# Altium project ELOAD.PrjPcb (part 2 of 2)

## Sheet INKEY.SchDoc: =DocumentName
size A4; CompanyName: "AS Manufacturing" LLC; Organization: "AS Manufacturing" LLC; Address1: 5 Sklyarenka St.; Address2: Kyiv 04073; Address3: Ukraine; Address4: https://ajax.systems/en/; DocumentNumber: 6; Revision: v1; SheetNumber: 6; SheetTotal: 7; Product name: DEV.Tnn.BRD; Internal reference: 621; Head: DEV.Tnn.BRD.621.v1; PCB_Designator: DEV.Tnn.BRD.621.v1; Template_version: 1.0.1
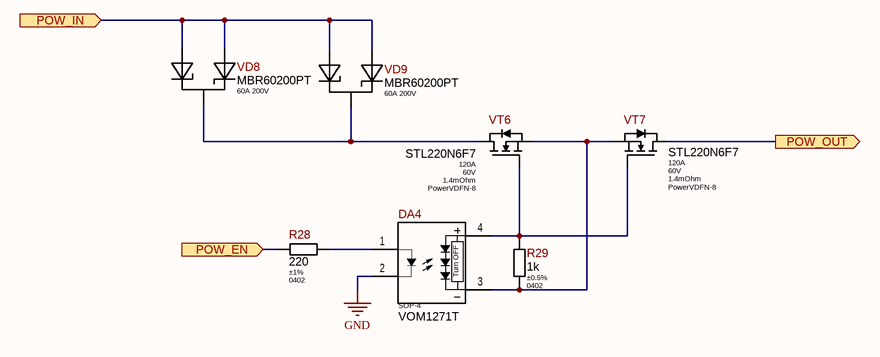
[diagram p5: INKEY.SchDoc]

### Parts
DA4  Package: SOP-4  [SOP-4P254_492X720X222L65X51N]  (hidden comment: VOM1271T)
R28  Tolerance: ±1%  Package: 0402  [R_ANY_CHIP_0402_MED]  (hidden comment: 220)
R29  Tolerance: ±0.5%  Package: 0402  [R_ANY_CHIP_0402_MED]  (hidden comment: 1k)
VD8  MBR60200PT  Power Rating: 60A 200V  [TO220-AB-H]
VD9  MBR60200PT  Power Rating: 60A 200V  [TO220-AB-H]
VT6  Id: 120A  Vds: 60V  Rds: 1.4mOhm  Package: PowerVDFN-8  [VSONP-CLIP-8_5.0x6.00mm]  (hidden comment: STL220N6F7)
VT7  Id: 120A  Vds: 60V  Rds: 1.4mOhm  Package: PowerVDFN-8  [VSONP-CLIP-8_5.0x6.00mm]  (hidden comment: STL220N6F7)

### Ports
POW_EN (in), POW_IN (in), POW_OUT (out)

### Nets
EXTI: VD8.1 VD8.3 VD9.1 VD9.3 ; port POW_IN
GND: DA4.2(Cathode)
POWER: VT7.D(Drain) ; port POW_OUT
cPOW_EN: R28.1 ; port POW_EN
NetDA4_1: DA4.1(Anode) R28.2
NetDA4_3: DA4.3(Emitter) R29.2 VT6.S(Source) VT7.S(Source)
NetDA4_4: DA4.4(Collector) R29.1 VT6.G(Gate) VT7.G(Gate)
NetVD8_2: VD8.2 VD9.2 VT6.D(Drain)

### Notes on the sheet
- Title
- Product:
- Project:
- Size:
- Date:
- Variant:
- A4
- Authors:
- Time:
- Sheet
- of
- Rev:
- Commit:
- (in symbol VOM1271T) Turn OFF

### Library data of the parts
DA4 = VOM1271T: Photovoltaic MOSFET Driver with Integrated Fast Turn-Off, 3750 VRMS; Manufacturer: Vishay Semiconductors; Ajax_1C_ID: 15545; Ajax_1C_PN: VOM1271T оптрон; Ajax_1С_Status: Mass Production; Component Status: Released; Wavelength: NONE; GUID_1C: d92e23f6-5530-11e9-ab4e-0050569f2651; Part Number: VOM1271T; Part Type: Optocoupler; Component Type: SMD; Color: NONE; Temperature Range: -40°C ~ 100°C; ComponentLink1URL: https://www.vishay.com/docs/83469/vom1271.pdf; Supplier 1: Digi-Key; Supplier Part Number 1: VOM1271TTR-ND; Replacement: NONE; Price: 1.2896; ComponentLink1Description: Datasheet
R28 = RC0402FR-07220RL: 220 Ohms ±1% 1/16W 0402 Thick Film Resistor; Manufacturer: Yageo; Ajax_1C_ID: 6466; Ajax_1C_PN: 220R 1% 0402 Resistors SMD RoHS; Ajax_1С_Status: Mass Production; Component Status: Released; Power Rating: 0.062W; Voltage: 50V; Temperature Stability: ±100ppm/°C; Replacement: NONE; GUID_1C: c8eea36b-fd66-11e4-ad28-a45d36c4a9e5; Value: 220; Part Number: RC0402FR-07220RL; Part Type: Thick Film; Component Type: SMD; Temperature Range: -55°C ~ 155°C; ComponentLink1URL: https://eu.mouser.com/datasheet/2/447/PYu_RC_Group_51_RoHS_L_10-1664068.pdf; Price: 0.0007; ComponentLink1Description: Datasheet
R29 = RC0402DR-071KL: 1 kOhms ±0.5% 1/16W 0402 Thick Film Resistor; Manufacturer: Yageo; Ajax_1C_ID: 54619; Ajax_1C_PN: 1k 0.5% 0402 RC0402DR-071KL Resistors SMD RoHS; Ajax_1С_Status: Mass Production; Component Status: Released; Power Rating: 0.062W; Voltage: 50V; Temperature Stability: ±100ppm/°C; Replacement: NONE; GUID_1C: a470e21a-6423-11ed-a366-005056994834; Value: 1k; Part Number: RC0402DR-071KL; Part Type: Thick Film; Component Type: SMD; Temperature Range: -55°C ~ 155°C; ComponentLink1URL: https://www.yageo.com/upload/media/product/productsearch/datasheet/rchip/PYu-RC_Group_51_RoHS_L_12.pdf; Supplier 1: Digi-Key; Supplier Part Number 1: 13-RC0402DR-071KLTR-ND; Price: 0.015; ComponentLink1Description: Datasheet
VD8 VD9 = MBR60200PT: DIODE ARR SCHOT 200V 30A TO247-3; Manufacturer: Micro Commercial Co; Manufacturer P/N: MBR60200PT-BP; Name Component: Diode Schottky; Operation Temperature: -55°C ~ 150°C; Library Path 1: Diodes.SchLib; Part Number: MBR60200PT; Value: MBR60200PT; Package/Case: TO-247; Supplier 1: Digi-key; Supplier Part Number 1: 353-MBR60200PT-BP-ND; ComponentLink1Description: Datasheet; ComponentLink1URL: https://www.mccsemi.com/pdf/Products/MBR60200PT(TO-247).pdf
VT6 VT7 = STL220N6F7: 60V, 120A max N-Channel Power MOSFET, 1.2mOhm @ Vgs = 10V; Manufacturer: STMicroelectronics; Ajax_1C_ID: 113144; Ajax_1C_PN: STL220N6F7 60V 120A N-Channel MOSFET POWERFLAT Transistor STMicroelectronics SMD RoHS; Ajax_1С_Status: Mass Production; Component Status: Released; Standard Lead Time: 26 Weeks; Replacement: NONE; GUID_1C: 27ae4649-73fe-11ef-b976-00505699fadc; Part Number: STL220N6F7; Part Type: N-Channel; Component Type: SMD; Temperature Range: -55°C ~ 175°C; ComponentLink1URL: https://eu.mouser.com/datasheet/2/389/stl220n6f7-1851066.pdf; Supplier 1: Digi-Key; Supplier Part Number 1: 497-STL220N6F7TR-ND; Price: 1.47; ComponentLink1Description: Datasheet

## Sheet LOAD.SchDoc: =DocumentName
size 297 x 209 mm; CompanyName: "AS Manufacturing" LLC; Organization: "AS Manufacturing" LLC; Address1: 5 Sklyarenka St.; Address2: Kyiv 04073; Address3: Ukraine; Address4: https://ajax.systems/en/; DocumentNumber: 2; Revision: v1; SheetNumber: 2; SheetTotal: 7; Product name: DEV.Tnn.BRD; Internal reference: 621; Head: DEV.Tnn.BRD.621.v1; PCB_Designator: DEV.Tnn.BRD.621.v1; Template_version: 1.0.1
Used 5 times, as channels LOAD, LOAD, LOAD, LOAD, LOAD. Parts and nets are listed once, with the designators drawn on the sheet.
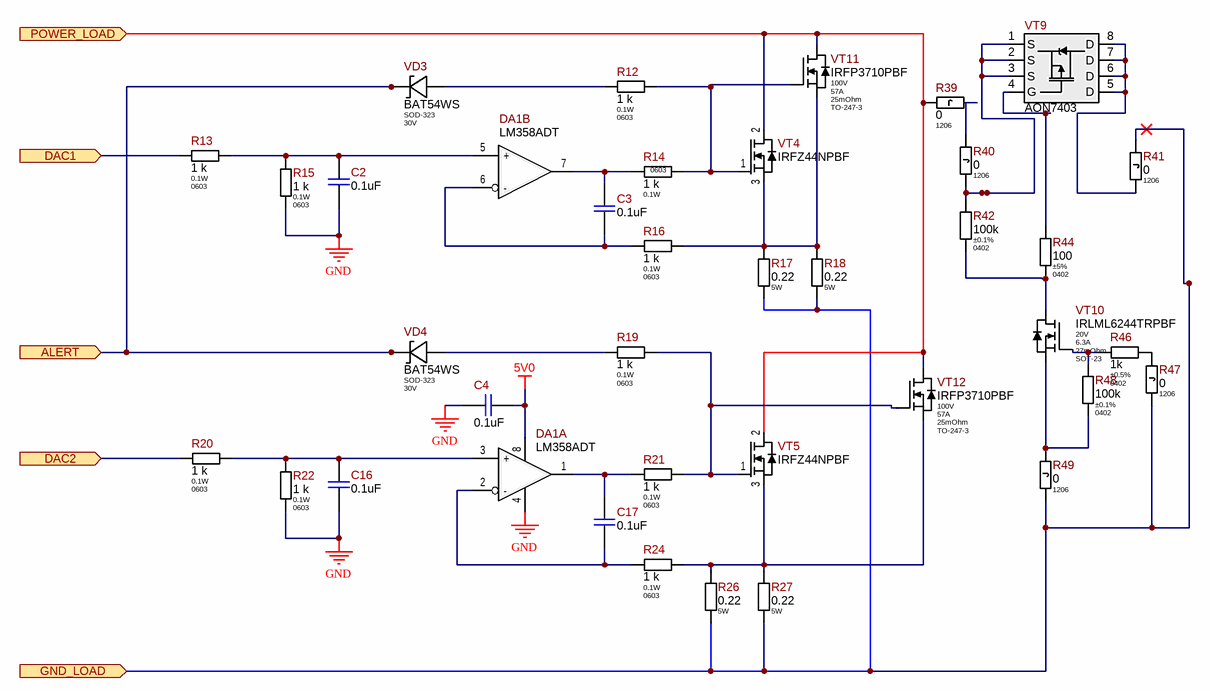
[diagram p6: LOAD.SchDoc]

### Parts
C2  0.1uF  [C0603(1608)]
C3  0.1uF  [C0603(1608)]
C4  0.1uF  [C0603(1608)]
C16  0.1uF  [C0603(1608)]
C17  0.1uF  [C0603(1608)]
DA1  LM358ADT  [SOIC8]  (parts A,B of 2)
R12  1 k  Power Rating: 0.1W  Package/Case: 0603  [R0603]
R13  1 k  Power Rating: 0.1W  Package/Case: 0603  [R0603]
R14  1 k  Power Rating: 0.1W  Package/Case: 0603  [R0603]
R15  1 k  Power Rating: 0.1W  Package/Case: 0603  [R0603]
R16  1 k  Power Rating: 0.1W  Package/Case: 0603  [R0603]
R17  0.22  Power Rating: 5W  [R5W]
R18  0.22  Power Rating: 5W  [R5W]
R19  1 k  Power Rating: 0.1W  Package/Case: 0603  [R0603]
R20  1 k  Power Rating: 0.1W  Package/Case: 0603  [R0603]
R21  1 k  Power Rating: 0.1W  Package/Case: 0603  [R0603]
R22  1 k  Power Rating: 0.1W  Package/Case: 0603  [R0603]
R24  1 k  Power Rating: 0.1W  Package/Case: 0603  [R0603]
R26  0.22  Power Rating: 5W  [R5W]
R27  0.22  Power Rating: 5W  [R5W]
R39  Package: 1206  [R_ANY_CHIP_1206_MED]  (hidden comment: 0)
R40  Package: 1206  [R_ANY_CHIP_1206_MED]  (hidden comment: 0)
R41  Package: 1206  [R_ANY_CHIP_1206_MED]  (hidden comment: 0)
R42  Tolerance: ±0.1%  Package: 0402  [R_ANY_CHIP_0402_MED]  (hidden comment: 100k)
R44  Tolerance: ±5%  Package: 0402  [R_ANY_CHIP_0402_MED]  (hidden comment: 100)
R46  Tolerance: ±0.5%  Package: 0402  [R_ANY_CHIP_0402_MED]  (hidden comment: 1k)
R47  Package: 1206  [R_ANY_CHIP_1206_MED]  (hidden comment: 0)
R48  Tolerance: ±0.1%  Package: 0402  [R_ANY_CHIP_0402_MED]  (hidden comment: 100k)
R49  Package: 1206  [R_ANY_CHIP_1206_MED]  (hidden comment: 0)
VD3  BAT54WS  Package: SOD-323  Voltage: 30V  [SOD-323_MED]
VD4  BAT54WS  Package: SOD-323  Voltage: 30V  [SOD-323_MED]
VT4  IRFZ44NPBF  [TO-220]
VT5  IRFZ44NPBF  [TO-220]
VT9  AON7403  [DFN3X3]
VT10  Part Number: IRLML6244TRPBF  Vds: 20V  Id: 6.3A  Rds: 27mOhm  Package: SOT-23  [SOT-23_MED]  (hidden comment: IRLML6244)
VT11  Vds: 100V  Id: 57A  Rds: 25mOhm  [TO-247-3]  (hidden comment: IRFP3710PBF)
VT12  Vds: 100V  Id: 57A  Rds: 25mOhm  [TO-247-3]  (hidden comment: IRFP3710PBF)

### Ports
ALERT (in), DAC1 (in), DAC2 (in), GND_LOAD (in), POWER_LOAD (in)

### Nets
5V0: C4.1 DA1.8(V+)
GND: C2.2 C4.2 C16.2 DA1.4(V-) R15.1 R22.1
ALERT: VD3.CA VD4.CA ; port ALERT
DAC1: R13.1 ; port DAC1
DAC2: R20.1 ; port DAC2
GND_LOAD: R17.1 R18.1 R26.1 R27.1 R41.1 R47.2 R49.2 ; port GND_LOAD
POWER_LOAD: R39.1 VT4.2(D) VT5.2(D) VT11.2(D) VT12.2(D) ; port POWER_LOAD
NetC2_1: C2.1 DA1.5(+) R13.2 R15.2
NetC3_1: C3.1 DA1.7(Out) R14.1
NetC3_2: C3.2 DA1.6(-) R16.1
NetC16_1: C16.1 DA1.3(+) R20.2 R22.2
NetC17_1: C17.1 DA1.1(Out) R21.1
NetC17_2: C17.2 DA1.2(-) R24.1
NetR12_1: R12.1 VD3.AN
NetR12_2: R12.2 R14.2 VT4.1(G) VT11.1(G)
NetR16_2: R16.2 R17.2 R18.2 VT4.3(S) VT11.3(S)
NetR19_1: R19.1 VD4.AN
NetR19_2: R19.2 R21.2 VT5.1(G) VT12.1(G)
NetR24_2: R24.2 R26.2 R27.2 VT5.3(S) VT12.3(S)
NetR39_2: R39.2 R40.1
NetR40_2: R40.2 R42.1 VT9.1(S) VT9.2(S) VT9.3(S)
NetR41_2: R41.2 VT9.5(D) VT9.6(D) VT9.7(D) VT9.8(D)
NetR42_2: R42.2 R44.2 VT10.3(D)
NetR44_1: R44.1 VT9.4(G)
NetR46_1: R46.1 R47.1
NetR46_2: R46.2 R48.1 VT10.1(G)
NetR48_2: R48.2 R49.1 VT10.2(S)

### Channels
LOAD: designators C2=C2E C3=C3E C4=C4E C16=C16E C17=C17E DA1=DA1E R12=R12E R13=R13E R14=R14E R15=R15E R16=R16E R17=R17E R18=R18A R19=R19E R20=R20E R21=R21E R22=R22E R24=R24E R26=R26E R27=R27A R39=R39E R40=R40E R41=R41E R42=R42E R44=R44E R46=R46E R47=R47E R48=R48E R49=R49E VD3=VD3E VD4=VD4E VT4=VT4E VT5=VT5E VT9=VT9E VT10=VT10E VT11=VT11E VT12=VT12E; ports ALERT=NetVD3A_CA DAC1=VREF5 DAC2=VREF6 GND_LOAD=NetR17B_1 POWER_LOAD=POWER
LOAD: designators C2=C2D C3=C3D C4=C4D C16=C16D C17=C17D DA1=DA1D R12=R12D R13=R13D R14=R14D R15=R15D R16=R16D R17=R17D R18=R18B R19=R19D R20=R20D R21=R21D R22=R22D R24=R24D R26=R26D R27=R27B R39=R39D R40=R40D R41=R41D R42=R42D R44=R44D R46=R46D R47=R47D R48=R48D R49=R49D VD3=VD3D VD4=VD4D VT4=VT4D VT5=VT5D VT9=VT9D VT10=VT10D VT11=VT11D VT12=VT12D; ports ALERT=NetVD3A_CA DAC1=VREF7 DAC2=VREF8 GND_LOAD=NetR17C_1 POWER_LOAD=POWER
LOAD: designators end in C; ports ALERT=NetVD3A_CA DAC1=VREF9 DAC2=VREF10 GND_LOAD=NetR17C_1 POWER_LOAD=POWER
LOAD: designators C2=C2B C3=C3B C4=C4B C16=C16B C17=C17B DA1=DA1B R12=R12B R13=R13B R14=R14B R15=R15B R16=R16B R17=R17B R18=R18D R19=R19B R20=R20B R21=R21B R22=R22B R24=R24B R26=R26B R27=R27D R39=R39B R40=R40B R41=R41B R42=R42B R44=R44B R46=R46B R47=R47B R48=R48B R49=R49B VD3=VD3B VD4=VD4B VT4=VT4B VT5=VT5B VT9=VT9B VT10=VT10B VT11=VT11B VT12=VT12B; ports ALERT=NetVD3A_CA DAC1=VREF3 DAC2=VREF4 GND_LOAD=NetR17B_1 POWER_LOAD=POWER
LOAD: designators C2=C2A C3=C3A C4=C4A C16=C16A C17=C17A DA1=DA1A R12=R12A R13=R13A R14=R14A R15=R15A R16=R16A R17=R17A R18=R18E R19=R19A R20=R20A R21=R21A R22=R22A R24=R24A R26=R26A R27=R27E R39=R39A R40=R40A R41=R41A R42=R42A R44=R44A R46=R46A R47=R47A R48=R48A R49=R49A VD3=VD3A VD4=VD4A VT4=VT4A VT5=VT5A VT9=VT9A VT10=VT10A VT11=VT11A VT12=VT12A; ports ALERT=NetVD3A_CA DAC1=VREF1 DAC2=VREF2 GND_LOAD=NetR17A_1 POWER_LOAD=POWER

### Notes on the sheet
- 1
- 2
- 3
- 4
- 5
- 6
- C
- D
- E
- F
- Назва проекту
- Мова
- UA
- Розробник
- Формат
- A4
- Версія
- Дата
- Лист
- /

### Library data of the parts
C2-C4 C16 C17 = 0.1uF  50V C0603: CAP CER 0.1UF 50V X7R 0603; Manufacturer: Samsung Electro-Mechanics; Manufacturer P/N: CL10B104KB8WPNC; Name Component: Capacitor Ceramic; Tolerance: ±10%; Operation Temperature: -55°C ~ 125°C; Library Path 1: Capacitors.SchLib; Notes: 06035C104K4T4A, 06035C104K4T2A; Part Number: 0.1uF  50V C0603; Value: 0.1uF; Temperature Coefficient: X7R; Power (V/A): 50V; Package/Case: C0603; Supplier Part Number 1: 1276-6854-2-ND; ComponentLink1Description: Datasheet; Supplier 1: Digi-key; ComponentLink1URL: https://www.samsungsem.com/resources/file/global/support/product_catalog/MLCC.pdf
DA1 = LM358ADT: IC OPAMP GP 2 CIRCUIT 8SOIC  1.1 MHz   3V...30V; Manufacturer: Texas Instruments; Manufacturer P/N: LM358ADR; Name Component: Comparators; Operation Temperature: 0°C ~ 70°C; Power (V/A): 3V ~ 30V; Library Path 1: Integrated Circuit.SchLib; ComponentLink1URL: https://www.st.com/content/ccc/resource/technical/document/datasheet/61/46/87/01/98/ed/44/c5/CD00000464.pdf/files/CD00000464.pdf/jcr:content/translations/en.CD00000464.pdf; ComponentLink1Description: Datasheet; Part Number: LM358ADT; Value: LM358ADT; Package/Case: 8-SOIC; Supplier 1: Kosmodrom; Supplier Part Number 1: LM358ADT
R12-R16 R19-R22 R24 = 1 k  R0603: RES SMD 1 k OHM  ±1% 1/10W 0603; Name Component: Resistror; Operation Temperature: -55℃ to 155℃; Temperature Coefficient: ±100 ppm/°C; Library Path 1: Resistor.SchLib; Part Number: 1 k  R0603; Value: 1 k; Tolerance: ±1%
R17 R18 R26 R27 = 47  RES_5W: Resistror 47 OHM  ±10% AXIAL  9.00mm x 22.00mm; Operation Temperature: -55℃ to 155℃; Temperature Coefficient: ±100 ppm/°C; Library Path 1: Resistor.SchLib; Part Number: 47  RES_5W; Name Component: Resistror; Value: 0.22; Tolerance: ±10%
R39-R41 R47 R49 = RCS12060000Z0EA: 0 Ohms Jumper, 1/2W 1206 Thick Film Resistor; Manufacturer: Vishay; Tolerance: 0.5%; Ajax_1C_ID: 28766; Ajax_1C_PN: 0R Jumper 1206 1/2W Resistors SMD RoHS; Ajax_1С_Status: Mass Production; Component Status: Released; Power Rating: 0.5W; Voltage: NONE; GUID_1C: 39e965f6-9d2d-11eb-ab70-0050569f2651; Value: 0; Part Number: RCS12060000Z0EA; Part Type: Thick Film; Component Type: SMD; Temperature Stability: NONE; Temperature Range: -55°C ~ 155°C; ComponentLink1URL: https://eu.mouser.com/datasheet/2/427/rcse3-1761771.pdf; Supplier 1: Mouser; Supplier Part Number 1: 71-RCS12060000Z0EA; Replacement: NONE; Price: 0.023; ComponentLink1Description: Datasheet
R42 R48 = WF04U1003BTL: 100 kOhms ±0.1%, 1/16W 0402 Thin Film Resistor; Manufacturer: Walsin Technology Corporation; Ajax_1C_ID: 137562; Ajax_1C_PN: 100k 0.1% 0402 62.5mW WF04U1003BTL Walsin Thin Film Resistors SMD RoHS; Ajax_1С_Status: Substitution; Component Status: Review; Power Rating: 0.062W; Voltage: 50V; Temperature Stability: ±25ppm/°C; Replacement: NONE; GUID_1C: d33922d2-2bd8-11f0-b984-00505699fadc; Value: 100k; Part Number: WF04U1003BTL; Part Type: Thin Film; Component Type: SMD; Temperature Range: -55°C ~ 155°C; ComponentLink1URL: https://www.passivecomponent.com/wp-content/uploads/thin_film/ASC_WFxxT&U.pdf; Supplier 1: Digi-Key; Supplier Part Number 1: 1292-WF04U1003BTLTR-ND; Price: 0.109; ComponentLink1Description: Datasheet
R44 = RC0402JR-07100RL: 100 Ohms ±5% 1/16W 0402 Thick Film Resistor; Manufacturer: Yageo; Ajax_1C_ID: 4879; Ajax_1C_PN: 100R 5% 0402 Resistors SMD RoHS; Ajax_1С_Status: Mass Production; Component Status: Released; Power Rating: 0.062W; Voltage: 50V; Temperature Stability: ±100ppm/°C; Replacement: NONE; GUID_1C: 955d0a6e-1239-11e4-b679-a45d36c4a9e5; Value: 100; Part Number: RC0402JR-07100RL; Part Type: Thick Film; Component Type: SMD; Temperature Range: -55°C ~ 155°C; ComponentLink1URL: https://eu.mouser.com/datasheet/2/447/PYu_RC_Group_51_RoHS_L_10-1664068.pdf; Supplier 1: Digi-Key; Supplier Part Number 1: 311-100JRTR-ND; Price: 0.00250459; ComponentLink1Description: Datasheet
R46 = RC0402DR-071KL: as R29 on sheet INKEY; Value: 1k; Part Number: RC0402DR-071KL; Part Type: Thick Film; Component Type: SMD; Temperature Range: -55°C ~ 155°C; ComponentLink1URL: https://www.yageo.com/upload/media/product/productsearch/datasheet/rchip/PYu-RC_Group_51_RoHS_L_12.pdf; Supplier 1: Digi-Key; Supplier Part Number 1: 13-RC0402DR-071KLTR-ND; Price: 0.015; ComponentLink1Description: Datasheet
VD3 VD4 = BAT54WS-7-F: Diode Schottky 30V 100mA, Fast Recovery 5ns, Low Leakage 2uA, SOD-323; Manufacturer: Diodes Incorporated; Ajax_1C_ID: 121513; Ajax_1C_PN: BAT54WS-7-F діод; Ajax_1С_Status: Mass Production; Component Status: Released; Marking: L9; Standard Lead Time: 8 Weeks; Vf: 500mV @ 30mA; Replacement: NONE; GUID_1C: e8a592fc-b25b-11ef-b620-0050569991a1; Part Number: BAT54WS-7-F; Supplier 1: Mouser; Supplier Part Number 1: 621-BAT54WS-F; ComponentLink1Description: Datasheet; ComponentLink1URL: https://eu.mouser.com/datasheet/2/115/DIOD_S_A0004140728_1-2542383.pdf; Part Type: Schottky; Component Type: SMD; Current: 100mA; Temperature Range: -65°C ~ 150°C; Price: 0.07452906
VT4 VT5 = IRFZ44NPBF: MOSFET N-CH 55V 49A TO220AB; Manufacturer: Infineon Technologies; Name Component: Transistor; Operation Temperature: -55°C ~ 175°C (TJ); Power Rating: 49A 55 В; Library Path 1: Transistors.SchLib; Part Number: IRFZ44NPBF; Value: IRFZ44NPBF; Package/Case: TO-220; Manufacturer P/N: IRFZ44NPBF; Supplier 1: Digi-key; Supplier Part Number 1: IRFZ44NPBF-ND; ComponentLink1Description: Datasheet; ComponentLink1URL: https://www.infineon.com/dgdl/irfz44npbf.pdf?fileId=5546d462533600a40153563b3a9f220d
VT9 = AON7403: P-Channel 30 V 11A (Ta), 29A (Tc) 3.1W (Ta), 25W (Tc) Surface Mount 8-DFN-EP (3x3); Manufacturer: Alpha & Omega Semiconductor Inc.; Name Component: Transistor; Operation Temperature: -55°C ~ 150°C (TJ); Power Rating: 30V 15A; Library Path 1: Transistors.SchLib; Part Number: AON7403; ComponentLink1URL: https://imrad.com.ua/userdata/modules/productFiles/XwMaVOEl_AON7403_ao.pdf; ComponentLink1Description: Datasheet; Supplier 1: Digi-key; Supplier Part Number 1: 785-1581-2-ND; Value: AON7403; Package/Case: DFN3x3; Manufacturer P/N: AON7403
VT10 = IRLML6244TRPBF: 20V, 6.3A max N-Channel HEXFET MOSFET, 21mOhm @ Vgs = 4.5V; Manufacturer: Infineon Technologies; Ajax_1C_ID: 5903; Ajax_1C_PN: IRLML6244TRPBF. польовий транзистор; Ajax_1С_Status: Mass Production; Component Status: Released; Standard Lead Time: 15 Weeks; Replacement: NONE; GUID_1C: 6032e646-a6d2-11e4-9c1d-a45d36c4a9e5; Part Type: N-Channel; Component Type: SMD; Temperature Range: -55°C ~ 150°C; ComponentLink1URL: https://eu.mouser.com/datasheet/2/196/Infineon_IRLML6244_DataSheet_v01_01_EN-3363560.pdf; Supplier 1: Digi-Key; Supplier Part Number 1: IRLML6244TRPBFTR-ND; Price: 0.053; ComponentLink1Description: Datasheet
VT11 VT12 = IRFP3710PBF: 100V, 57A max N-Channel HEXFET Power MOSFET, 25mOhm @ Vgs = 10V; Manufacturer: Infineon Technologies; Ajax_1C_ID: 182262; Ajax_1C_PN: IRFP3710PBF N-Channel 100V 57A TO-247-3 Infineon Technologies RoHS; Ajax_1С_Status: RND Only; Component Status: Review; Standard Lead Time: 35 Weeks; Replacement: NONE; Part Number: IRFP3710PBF; Package: TO-247-3; Part Type: N-Channel; Component Type: PTH; Temperature Range: -55°C ~ 175°C; ComponentLink1URL: https://www.infineon.com/assets/row/public/documents/24/49/infineon-irfp3710-datasheet-en.pdf; Supplier 1: Digi-Key; Supplier Part Number 1: IRFP3710PBF-ND; Price: NONE; ComponentLink1Description: Datasheet

## Nets that join several sheets
3V3: ELOAD (8 pins), MCU (C6.1 C7.2 L2.1 R53.2), U_DAC (C20B.1 C21B.1 DA3B.1), U_INA228 (C31C.2 C33C.2 D2C.6), U_INA228 (C31B.2 C33B.2 D2B.2 D2B.6), U_INA228 (5 pins), U_DAC (C20A.1 C21A.1 DA3A.1)
5V0: ELOAD (7 pins), LOAD (C4E.1 DA1E.8), LOAD (C4D.1 DA1D.8), LOAD (C4C.1 DA1C.8), LOAD (C4B.1 DA1B.8), LOAD (C4A.1 DA1A.8)
EXTI: ELOAD (5 pins), INKEY (VD8.1 VD8.3 VD9.1 VD9.3)
GND: ELOAD (33 pins), THERMO_SENSOR (RK1D.2), MCU (24 pins), U_DAC (C20B.2 C21B.2 DA3B.4 DA3B.10), U_INA228 (5 pins), U_INA228 (C31B.1 C33B.1 D2B.1 D2B.7), U_INA228 (C31A.1 C33A.1 D2A.7 R38A.2), INKEY (DA4.2), U_DAC (C20A.2 C21A.2 DA3A.4 DA3A.10), LOAD (6 pins), LOAD (6 pins), LOAD (6 pins), LOAD (6 pins), LOAD (6 pins), THERMO_SENSOR (RK1C.2), THERMO_SENSOR (RK1B.2), THERMO_SENSOR (RK1E.2), THERMO_SENSOR (RK1A.2), THERMO_SENSOR (RK1F.2)
POWER: INKEY (VT7.D), LOAD (5 pins), LOAD (5 pins), LOAD (5 pins), LOAD (5 pins), LOAD (5 pins)
cA0: ELOAD (MOD1.5), MCU (DD2.28)
cAL: ELOAD (R3.2 VT3.1), U_INA228 (D2C.3), U_INA228 (D2B.3), U_INA228 (D2A.3)
cALERT: ELOAD (R10.1), MCU (DD2.16)
cLED: ELOAD (MOD1.8), MCU (DD2.25)
cPWM_BUZ: ELOAD (R32.1 R33.2), MCU (DD2.32)
NetD2C_8: ELOAD (R1.2 R2.1 VD2.CA), U_INA228 (D2C.8)
NetR17A_1: ELOAD (R23.2), U_INA228 (R37C.2), LOAD (7 pins)
NetR17B_1: ELOAD (R23.1 R25.2), U_INA228 (R38C.2), U_INA228 (R37B.2), LOAD (7 pins), LOAD (7 pins)
NetR17C_1: ELOAD (R25.1 R36.2), U_INA228 (R38B.2), U_INA228 (R37A.2), LOAD (7 pins), LOAD (7 pins)
NetVD3A_CA: ELOAD (VT2.3), LOAD (VD3E.CA VD4E.CA), LOAD (VD3D.CA VD4D.CA), LOAD (VD3C.CA VD4C.CA), LOAD (VD3B.CA VD4B.CA), LOAD (VD3A.CA VD4A.CA)
nRST: ELOAD (MOD1.4), MCU (DD2.26)
SCL: ELOAD (MOD1.7), MCU (DD2.27), U_INA228 (D2C.5), U_INA228 (D2B.5), U_INA228 (D2A.5)
SCL1: MCU (DD2.31), U_DAC (DA3B.2)
SCL2: MCU (DD2.39), U_DAC (DA3A.2)
SDA: ELOAD (MOD1.6), MCU (DD2.29), U_INA228 (D2C.4), U_INA228 (D2B.4), U_INA228 (D2A.4)
SDA1: MCU (DD2.30), U_DAC (DA3B.3)
SDA2: MCU (DD2.44), U_DAC (DA3A.3)
VREF1: U_DAC (DA3B.8), LOAD (R13A.1)
VREF2: U_DAC (DA3B.9), LOAD (R20A.1)
VREF3: U_DAC (DA3B.6), LOAD (R13B.1)
VREF4: U_DAC (DA3B.7), LOAD (R20B.1)
VREF5: U_DAC (DA3A.6), LOAD (R13E.1)
VREF6: U_DAC (DA3A.7), LOAD (R20E.1)
VREF7: U_DAC (DA3A.8), LOAD (R13D.1)
VREF8: U_DAC (DA3A.9), LOAD (R20D.1)
VREF9: MCU (DD2.12), LOAD (R13C.1)
VREF10: MCU (DD2.13), LOAD (R20C.1)
xALERT: ELOAD (R11.1), MCU (DD2.17)
xENC_A: ELOAD (R43.2), MCU (DD2.42)
xENC_B: ELOAD (R45.2), MCU (DD2.41)
xENC_BUTTON: ELOAD (R9.2), MCU (DD2.2)
xTHERMO_SENS1: THERMO_SENSOR (10kD.1 RK1D.1), MCU (DD2.8)
xTHERMO_SENS2: MCU (DD2.9), THERMO_SENSOR (10kC.1 RK1C.1)
xTHERMO_SENS3: MCU (DD2.10), THERMO_SENSOR (10kB.1 RK1B.1)
xTHERMO_SENS4: MCU (DD2.11), THERMO_SENSOR (10kE#1.1 RK1E.1)
xTHERMO_SENS5: MCU (DD2.14), THERMO_SENSOR (10kE#2.1 RK1A.1)
xTHERMO_SENS6: MCU (DD2.15), THERMO_SENSOR (10kF.1 RK1F.1)